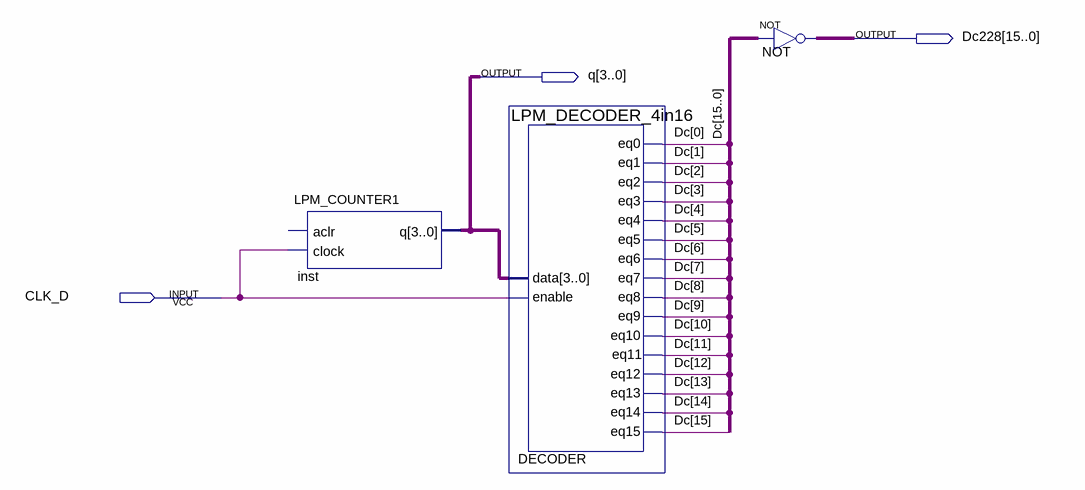
[diagram p0: schematic sheet]
// Quartus schematic Block_3_16sig.bdf as structural Verilog: 3 symbols, 3 pins
module Block_3_16sig (
  input  CLK_D,
  output [15:0] Dc228,
  output [3:0] q
);

  wire [15:0] Dc;

  LPM_COUNTER1 inst (.clock(CLK_D), .q(q));  // open: aclr
  LPM_DECODER_4in16 DECODER (
    .data(q), .enable(CLK_D), .eq0(Dc[0]), .eq1(Dc[1]), .eq2(Dc[2]), .eq3(Dc[3]), .eq4(Dc[4]), .eq5(Dc[5]),
    .eq6(Dc[6]), .eq7(Dc[7]), .eq8(Dc[8]), .eq9(Dc[9]), .eq10(Dc[10]), .eq11(Dc[11]), .eq12(Dc[12]),
    .eq13(Dc[13]), .eq14(Dc[14]), .eq15(Dc[15]));
  assign Dc228 = ~Dc;  // NOT NOT, 16 bits wide
endmodule
